# EasyEDA Pro project split-keyboard.epro, board PCB2_1
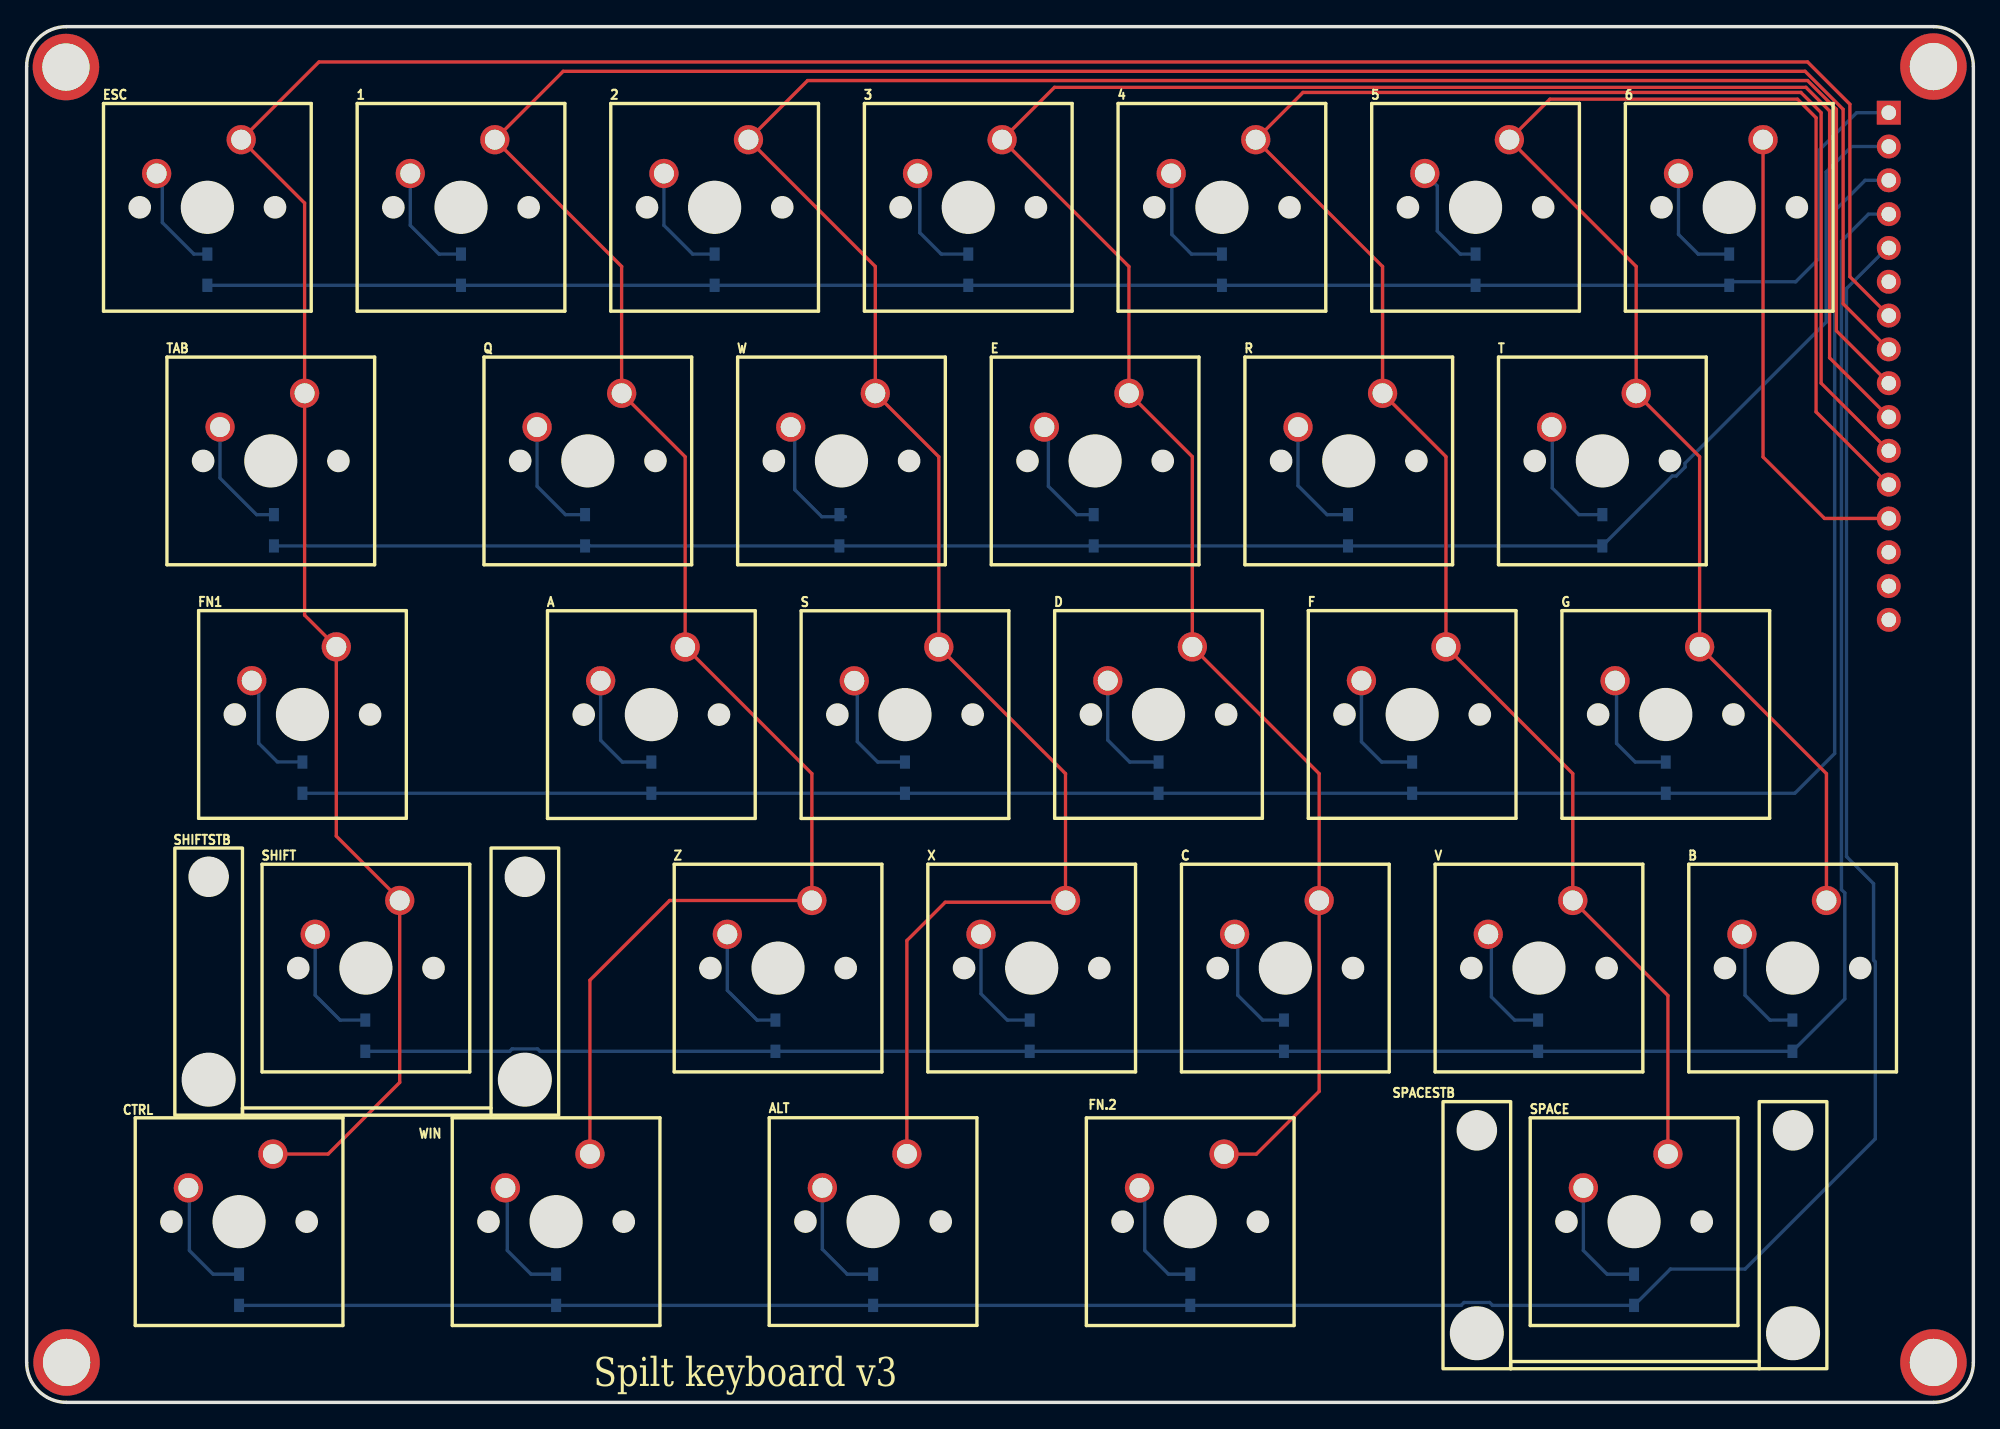
[diagram p5: board, top side]
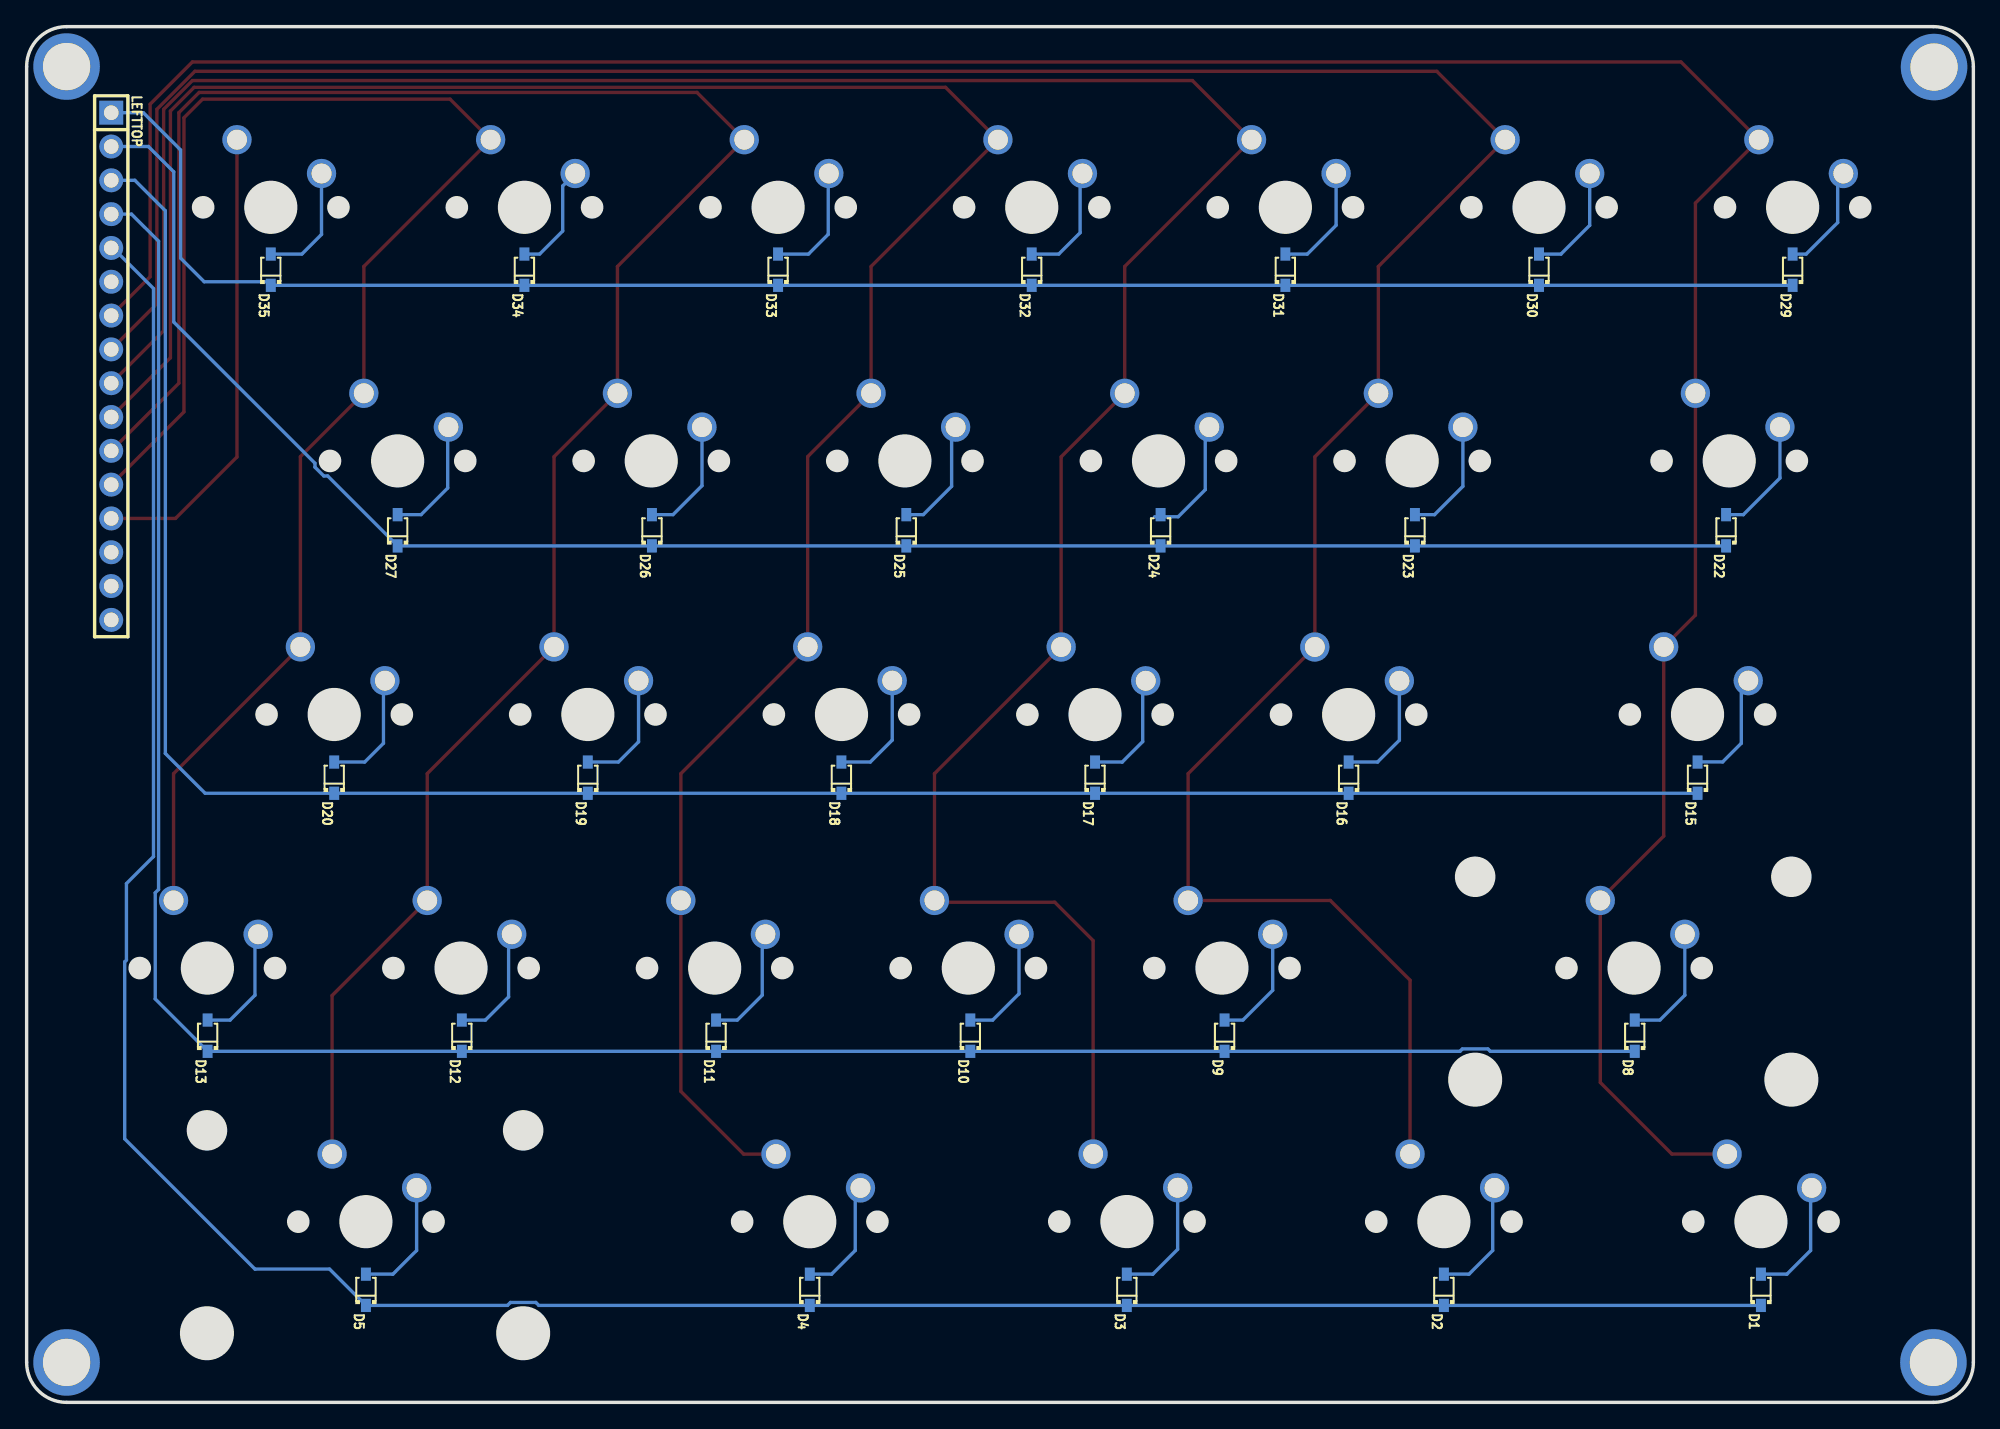
[diagram p6: board, bottom side, seen from below]

Outline 146.21 x 103.35 mm; copper layers: Top Layer, Bottom Layer. Coordinates in mm from the lower left corner of the outline.
Outline path: 0,100.35 0,3 arc(0.88,0.88) 3,0 143.21,0 arc(145.33,0.88) 146.21,3 146.21,100.35 arc(145.33,102.47) 143.21,103.35 3,103.35 arc(0.88,102.47) 0,100.35
Stack: Top Layer 0.035mm / Dielectric1 1.51mm FR4 er 4.5 / Bottom Layer 0.035mm

## Design rules (mm)
template: JLCPCB Capability(Two Layers Board)
spacing copperThickness1oz (default): track to track 0.102, other pairs 0.152 to 0.3
spacing copperThickness2oz: track to track 0.203, other pairs 0.152 to 0.3
track width copperThickness1oz (default): min 0.127, default 0.254, max 2.54
track width copperThickness2oz: min 0.203, default 0.254, max 2.54
differential pair differentialPair (default): width min 0.127, default 0.254, max 2.54; gap min 0.152, default 0.152
via viaSize (default): diameter min 0.5, default 0.61, max 10; hole min 0.3, default 0.305, max 6.3

## Placement (name value [footprint] x y rotation side)
1  MX1A-11NW  [cherry]  32.62 89.77 0 top
2  MX1A-11NW  [cherry]  51.67 89.77 0 top
3  MX1A-11NW  [cherry]  70.72 89.77 0 top
4  MX1A-11NW  [cherry]  89.77 89.77 0 top
5  MX1A-11NW  [cherry]  108.82 89.77 0 top
6  MX1A-11NW  [cherry]  127.87 89.77 0 top
A  MX1A-11NW  [cherry]  46.92 51.67 0 top
ALT  MX1A-11NW  [cherry]  63.57 13.58 0 top
B  MX1A-11NW  [cherry]  132.64 32.63 0 top
C  MX1A-11NW  [cherry]  94.54 32.63 0 top
CTRL  MX1A-11NW  [cherry]  15.96 13.58 0 top
D  MX1A-11NW  [cherry]  85.01 51.68 0 top
D1  1N4148WS  [SOD-323_L1.8-W1.3-LS2.5-RD]  15.96 8.46 90 bottom
D2  1N4148WS  [SOD-323_L1.8-W1.3-LS2.5-RD]  39.77 8.46 90 bottom
D3  1N4148WS  [SOD-323_L1.8-W1.3-LS2.5-RD]  63.58 8.46 90 bottom
D4  1N4148WS  [SOD-323_L1.8-W1.3-LS2.5-RD]  87.39 8.46 90 bottom
D5  1N4148WS  [SOD-323_L1.8-W1.3-LS2.5-RD]  120.73 8.46 90 bottom
D8  1N4148WS  [SOD-323_L1.8-W1.3-LS2.5-RD]  25.43 27.55 90 bottom
D9  1N4148WS  [SOD-323_L1.8-W1.3-LS2.5-RD]  56.24 27.55 90 bottom
D10  1N4148WS  [SOD-323_L1.8-W1.3-LS2.5-RD]  75.34 27.55 90 bottom
D11  1N4148WS  [SOD-323_L1.8-W1.3-LS2.5-RD]  94.43 27.55 90 bottom
D12  1N4148WS  [SOD-323_L1.8-W1.3-LS2.5-RD]  113.52 27.55 90 bottom
D13  1N4148WS  [SOD-323_L1.8-W1.3-LS2.5-RD]  132.62 27.55 90 bottom
D15  1N4148WS  [SOD-323_L1.8-W1.3-LS2.5-RD]  20.72 46.93 90 bottom
D16  1N4148WS  [SOD-323_L1.8-W1.3-LS2.5-RD]  46.92 46.93 90 bottom
D17  1N4148WS  [SOD-323_L1.8-W1.3-LS2.5-RD]  65.97 46.93 90 bottom
D18  1N4148WS  [SOD-323_L1.8-W1.3-LS2.5-RD]  85.02 46.93 90 bottom
D19  1N4148WS  [SOD-323_L1.8-W1.3-LS2.5-RD]  104.06 46.93 90 bottom
D20  1N4148WS  [SOD-323_L1.8-W1.3-LS2.5-RD]  123.11 46.93 90 bottom
D22  1N4148WS  [SOD-323_L1.8-W1.3-LS2.5-RD]  18.57 65.51 90 bottom
D23  1N4148WS  [SOD-323_L1.8-W1.3-LS2.5-RD]  41.94 65.51 90 bottom
D24  1N4148WS  [SOD-323_L1.8-W1.3-LS2.5-RD]  61.04 65.51 90 bottom
D25  1N4148WS  [SOD-323_L1.8-W1.3-LS2.5-RD]  80.14 65.51 90 bottom
D26  1N4148WS  [SOD-323_L1.8-W1.3-LS2.5-RD]  99.25 65.51 90 bottom
D27  1N4148WS  [SOD-323_L1.8-W1.3-LS2.5-RD]  118.35 65.51 90 bottom
D29  1N4148WS  [SOD-323_L1.8-W1.3-LS2.5-RD]  13.57 85.09 90 bottom
D30  1N4148WS  [SOD-323_L1.8-W1.3-LS2.5-RD]  32.62 85.09 90 bottom
D31  1N4148WS  [SOD-323_L1.8-W1.3-LS2.5-RD]  51.67 85.09 90 bottom
D32  1N4148WS  [SOD-323_L1.8-W1.3-LS2.5-RD]  70.72 85.09 90 bottom
D33  1N4148WS  [SOD-323_L1.8-W1.3-LS2.5-RD]  89.77 85.09 90 bottom
D34  1N4148WS  [SOD-323_L1.8-W1.3-LS2.5-RD]  108.82 85.09 90 bottom
D35  1N4148WS  [SOD-323_L1.8-W1.3-LS2.5-RD]  127.87 85.09 90 bottom
E  MX1A-11NW  [cherry]  80.25 70.72 0 top
ESC  MX1A-11NW  [cherry]  13.57 89.77 0 top
F  MX1A-11NW  [cherry]  104.06 51.68 0 top
FN1  MX1A-11NW  [cherry]  20.72 51.68 0 top
FN.2  MX1A-11NW  [cherry]  87.39 13.57 0 top
G  MX1A-11NW  [cherry]  123.11 51.68 0 top
LEFTTOP  DS1021-1x16SF11-B  [HDR-TH_16P-P2.54-V-M]  139.86 77.83 270 bottom
NOREF  -  [Pad_e69]  143.21 100.35 0 top
NOREF#2  -  [Pad_e70]  3 3 0 top
NOREF#3  -  [Pad_e67]  2.95 100.31 0 top
NOREF#4  -  [Pad_e71]  143.21 3 0 top
Q  MX1A-11NW  [cherry]  42.15 70.72 0 top
R  MX1A-11NW  [cherry]  99.3 70.72 0 top
S  MX1A-11NW  [cherry]  65.97 51.67 0 top
SHIFT  MX1A-11NW  [cherry]  25.48 32.62 0 top
SHIFTSTB  -  [Cherry 2U Stabilizer Cutout]  25.48 32.62 0 top
SPACE  MX1A-11NW  [cherry]  120.73 13.58 0 top
SPACESTB  -  [Cherry 2U Stabilizer Cutout]  120.73 13.58 0 top
T  MX1A-11NW  [cherry]  118.35 70.72 0 top
TAB  MX1A-11NW  [cherry]  18.34 70.72 0 top
V  MX1A-11NW  [cherry]  113.59 32.63 0 top
W  MX1A-11NW  [cherry]  61.2 70.72 0 top
WIN  MX1A-11NW  [cherry]  39.77 13.58 0 top
X  MX1A-11NW  [cherry]  75.49 32.63 0 top
Z  MX1A-11NW  [cherry]  56.44 32.62 0 top

## Footprints (pads in the part's own frame, mm; a bottom-side part is the same pattern mirrored in y, then rotated)
cherry
  round 2.2 hole 1.5: 1(-3.81,2.54) 2(2.54,5.08)
HDR-TH_16P-P2.54-V-M
  rect 1.8x1.8 hole 1.1: 1(-19.05,0)
  round 1.8 hole 1.1: 2(-16.51,0) 3(-13.97,0) 4(-11.43,0) 5(-8.89,0) 6(-6.35,0) 7(-3.81,0) 8(-1.27,0) 9(1.27,0) 10(3.81,0) 11(6.35,0) 12(8.89,0) 13(11.43,0) 14(13.97,0) 15(16.51,0) 16(19.05,0)
Pad_e67
  round 5 hole 3.55: 1(0,0)
Pad_e69
  round 5 hole 3.55: 2(0,0)
Pad_e70
  round 5 hole 3.55: 3(0,0)
Pad_e71
  round 5 hole 3.55: 4(0,0)
SOD-323_L1.8-W1.3-LS2.5-RD
  rect 1x0.75 smd: 1(-1.173,0) 2(1.173,0)

## Nets
As in the schematic.

Pads without a net: LEFTTOP 6 14 15 16; NOREF 2; NOREF#2 3; NOREF#3 1; NOREF#4 4

## Routing (per net, layer and track width the routed paths; a pad name or vN(x,y) marks a point on that pad's centre or on a via; arc(x,y) is an arc through that point)
COL0: length 229.1
  Top Layer w0.254: CTRL.2 22.64,18.66 28.02,24.03 SHIFT.2 28.02,37.78 23.26,42.54 23.26,56.76 20.88,59.14 20.88,90.09 ESC.2 21.95,100.69 133.76,100.69 136.94,97.52 136.94,84.56 LEFTTOP.7
COL1: length 223.3
  Top Layer w0.254: LEFTTOP.8 136.43,82.53 136.43,97.14 133.57,99.99 40.3,99.99 1.2 44.69,85.33 Q.2 49.46,71.03 A.2 58.98,47.23 Z.2 48.3,37.7 42.31,31.72 WIN.2
COL2: length 202.9
  Top Layer w0.254: LEFTTOP.9 135.92,80.5 135.92,97.14 133.76,99.29 58.65,99.29 2.2 63.74,85.33 W.2 68.51,71.03 68.51,56.75 78.03,47.23 X.2 77.89,37.57 68.99,37.57 66.11,34.69 ALT.2
COL3: length 179.8
  Top Layer w0.254: FN.2.2 92.36,18.65 97.08,23.37 C.2 97.08,47.23 D.2 87.55,71.04 E.2 82.79,85.33 3.2 77.2,98.79 133.64,98.79 135.41,97.01 135.41,78.47 LEFTTOP.10
COL4: length 161.1
  Top Layer w0.254: SPACE.2 123.27,30.56 V.2 116.13,47.23 F.2 106.6,71.04 R.2 101.84,85.33 4.2 95.86,98.41 133.25,98.41 134.78,96.88 134.78,76.56 LEFTTOP.11
COL5: length 121.7
  Top Layer w0.254: B.2 135.18,47.23 G.2 125.65,71.04 T.2 120.89,85.33 5.2 114.41,97.9 133,97.9 134.4,96.5 134.4,74.4 LEFTTOP.12
COL6: length 35.2
  Top Layer w0.254: LEFTTOP.13 135.03,66.4 130.41,71.02 6.2
ROW0: length 136.4
  Bottom Layer w0.254: LEFTTOP.1 137.45,96.88 134.65,94.09 134.65,85.96 132.87,84.18 128.14,84.18 127.87,83.92 13.57,83.92
ROW1: length 140.5
  Bottom Layer w0.254: LEFTTOP.2 137.06,94.34 135.16,92.44 135.16,81.15 124.56,70.55 124.56,70.26 123.9,69.59 123.6,69.59 D27.1 D26.1 D25.1 D24.1 D23.1 D22.1
ROW2: length 162.1
  Bottom Layer w0.254: D15.1 D16.1 D17.1 D18.1 D19.1 D20.1 132.8,45.76 135.8,48.75 135.8,89.52 138.08,91.8 LEFTTOP.3
ROW3: length 174.3
  Bottom Layer w0.254: LEFTTOP.4 138.33,89.26 136.3,87.23 136.3,38.53 136.56,38.28 136.56,30.31 D13.1 D12.1 D11.1 D10.1 D9.1 38.56,26.37 38.38,26.55 36.46,26.55 36.28,26.37 D8.1
ROW4: length 197.5
  Bottom Layer w0.254: D1.1 D2.1 D3.1 D4.1 107.74,7.29 107.96,7.5 109.88,7.5 110.1,7.29 D5.1 123.46,10.01 129.06,10.01 138.85,19.8 138.85,33.09 138.72,33.22 138.72,38.97 136.68,41 136.68,83.67 139.73,86.72 LEFTTOP.5
$1N668: length 9.2
  Bottom Layer w0.254: CTRL.1 12.22,16.04 12.22,11.41 14,9.63 D1.2
$1N5446: length 9.2
  Bottom Layer w0.254: D2.2 37.88,9.63 36.1,11.41 36.1,15.97 WIN.1
$1N5517: length 9.2
  Bottom Layer w0.254: D3.2 61.63,9.63 59.76,11.5 ALT.1
$1N5588: length 9
  Bottom Layer w0.254: FN.2.1 83.98,15.72 83.98,11.41 85.76,9.63 D4.2
$1N5659: length 9.3
  Bottom Layer w0.254: D5.2 118.7,9.63 116.92,11.41 SPACE.1
$1N5872: length 9.1
  Bottom Layer w0.254: SHIFT.1 21.67,30.59 23.54,28.72 D8.2
$1N5943: length 8.8
  Bottom Layer w0.254: D9.2 54.86,28.72 52.63,30.95 Z.1
$1N6014: length 8.9
  Bottom Layer w0.254: D10.2 73.66,28.72 71.68,30.7 X.1
$1N6085: length 8.9
  Bottom Layer w0.254: D11.2 92.83,28.72 90.96,30.59 90.96,34.93 C.1
$1N6156: length 9
  Bottom Layer w0.254: D12.2 111.76,28.72 110.01,30.46 110.01,34.93 V.1
$1N6227: length 9
  Bottom Layer w0.254: B.1 129.06,34.93 129.06,30.59 130.93,28.72 D13.2
$1N6369: length 8.4
  Bottom Layer w0.254: 20.35,48.11 18.83,48.11 17.43,49.51 17.43,53.69 FN1.1
$1N6440: length 9
  Bottom Layer w0.254: D16.2 44.75,48.1 43.11,49.74 A.1
$1N6511: length 8.9
  Bottom Layer w0.254: S.1 62.39,53.98 62.39,49.64 63.92,48.1 D17.2
$1N6582: length 9
  Bottom Layer w0.254: D18.2 82.85,48.1 81.2,49.75 D.1
$1N6653: length 9
  Bottom Layer w0.254: D19.2 101.77,48.1 100.25,49.62 F.1
$1N6724: length 9
  Bottom Layer w0.254: G.1 119.41,54.11 119.41,49.51 120.82,48.1 D20.2
$1N6866: length 9
  Bottom Layer w0.254: TAB.1 14.53,69.43 17.27,66.69 D22.2
$1N6937: length 8.9
  Bottom Layer w0.254: D23.2 40.47,66.69 38.34,68.81 Q.1
$1N7008: length 9.5
  Bottom Layer w0.254: 61.5,66.53 59.72,66.53 57.69,68.56 57.69,72.96 W.1
$1N7079: length 8.9
  Bottom Layer w0.254: D25.2 78.87,66.69 76.74,68.81 76.74,72.96 E.1
$1N7150: length 9.1
  Bottom Layer w0.254: R.1 95.49,68.86 97.67,66.69 D26.2
$1N7221: length 9.2
  Bottom Layer w0.254: T.1 114.59,73.22 114.59,68.69 116.59,66.69 D27.2
$1N7363: length 8.2
  Bottom Layer w0.254: D29.2 12.56,86.26 10.19,88.63 10.19,91.89 9.76,92.31
$1N7434: length 8.6
  Bottom Layer w0.254: D30.2 30.97,86.26 28.81,88.42 28.81,92.31
$1N7505: length 8.6
  Bottom Layer w0.254: 47.86,92.31 47.86,88.42 50.02,86.26 D31.2
$1N7576: length 8.8
  Bottom Layer w0.254: 66.91,92.31 67.09,92.14 67.09,87.86 68.69,86.26 D32.2
$1N7647: length 9
  Bottom Layer w0.254: D33.2 87.49,86.26 86.01,87.74 86.01,92.27 85.96,92.31
$1N7718: length 8.3
  Bottom Layer w0.254: D34.2 107.68,86.26 105.95,87.99 105.95,91.38 105.01,92.31
$1N7789: length 9
  Bottom Layer w0.254: D35.2 125.54,86.26 124.06,87.74 6.1

## Text on the board
Top Silkscreen Layer: Spilt keyboard v3
